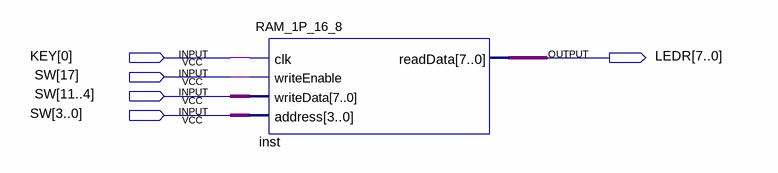
[diagram p0: schematic sheet]
// Quartus schematic RAM_1P_Demo.bdf as structural Verilog: 1 symbols, 5 pins
module RAM_1P_Demo (
  input  [0:0] KEY,
  input  [17:0] SW,
  output [7:0] LEDR
);

  RAM_1P_16_8 inst (.clk(KEY[0]), .writeEnable(SW[17]), .writeData(SW[11:4]), .address(SW[3:0]), .readData(LEDR));
endmodule
